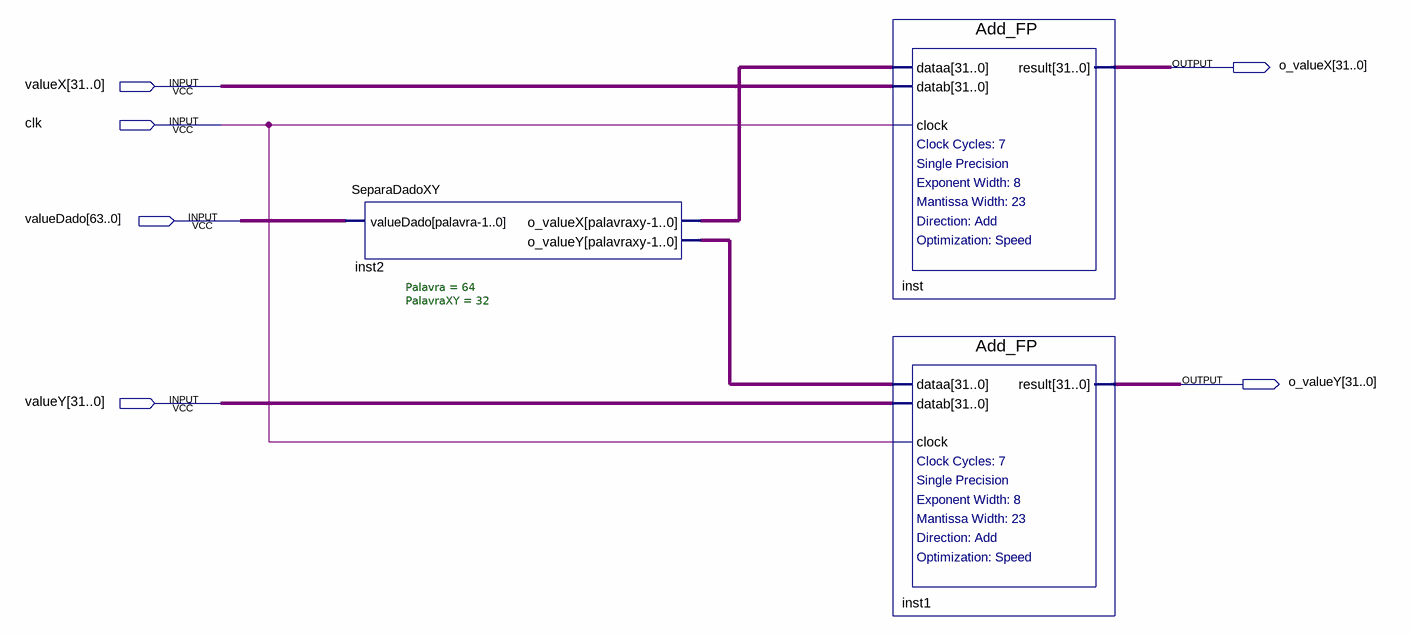
[diagram p0: schematic sheet]
// Quartus schematic SumCentroidValuesFP.bdf as structural Verilog: 3 symbols, 6 pins
module SumCentroidValuesFP (
  input  [31:0] valueX,
  input  clk,
  input  [63:0] valueDado,
  input  [31:0] valueY,
  output [31:0] o_valueX,
  output [31:0] o_valueY
);

  wire [31:0] inst2_o_valuex, inst2_o_valuey;

  SeparaDadoXY #(.Palavra(64), .PalavraXY(32)) inst2 (
    .valueDado(valueDado), .o_valueX(inst2_o_valuex), .o_valueY(inst2_o_valuey));
  Add_FP inst (.dataa(inst2_o_valuex), .datab(valueX), .clock(clk), .result(o_valueX));
  Add_FP inst1 (.dataa(inst2_o_valuey), .datab(valueY), .clock(clk), .result(o_valueY));
endmodule
